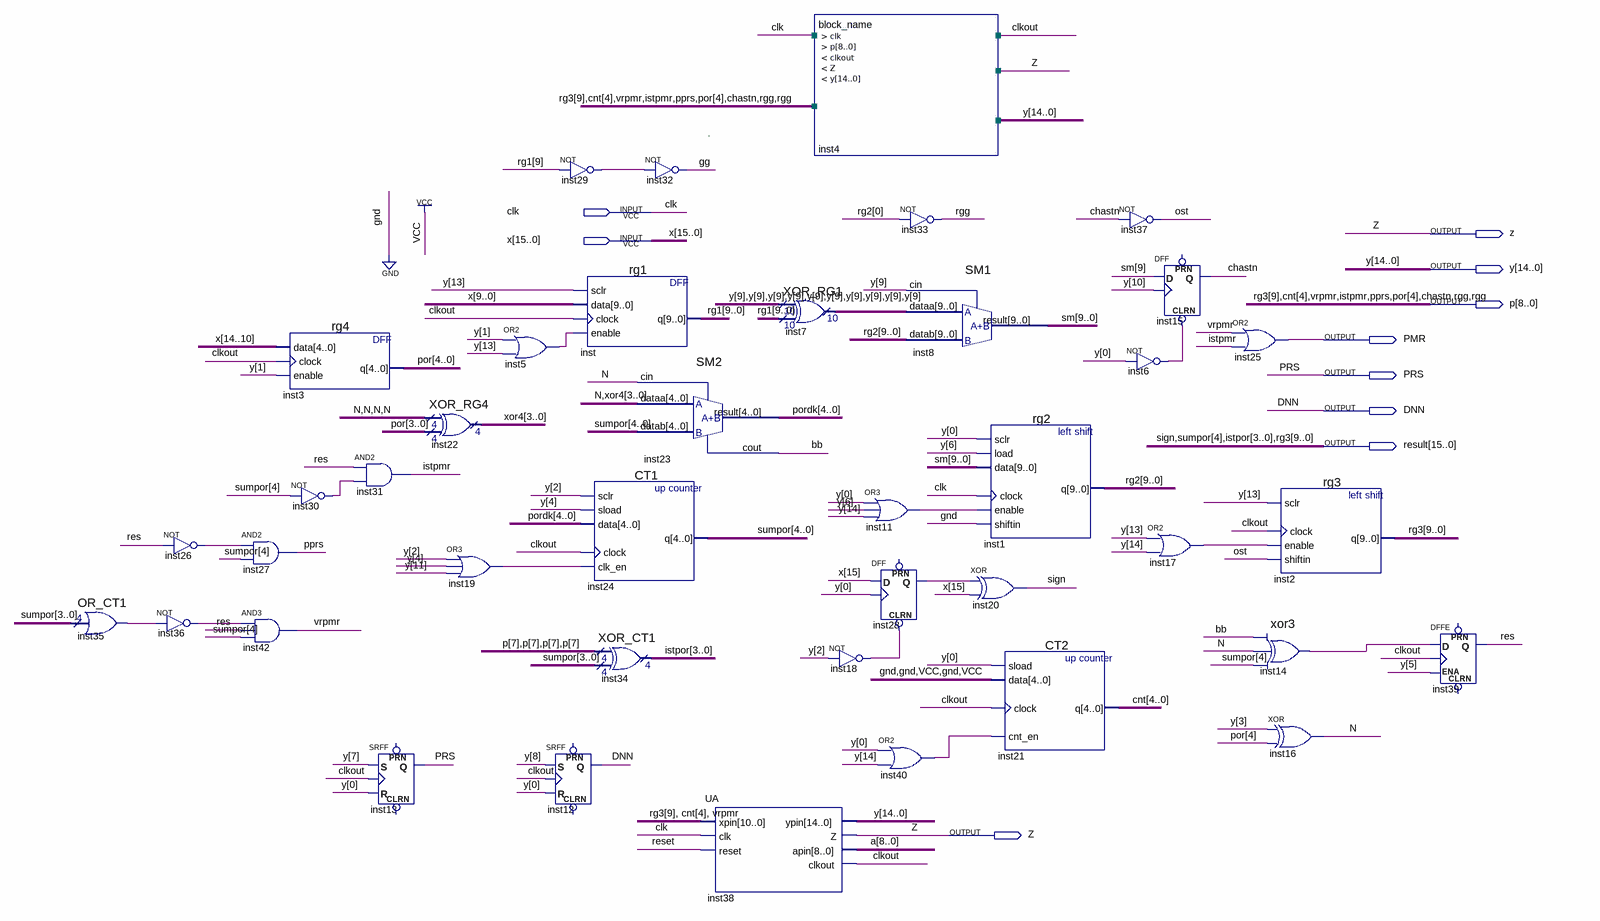
[diagram p0: schematic sheet]
// Quartus schematic Delenie.bdf as structural Verilog: 40 symbols, 10 pins
module Delenie (
  input  clk,
  input  [15:0] x,
  output z,
  output [14:0] y,
  output [8:0] p,
  output PMR,
  output PRS,
  output DNN,
  output [15:0] result
);

  wire bb, clkout, gg, inst5_out, inst6_out, inst11_out, inst14_result, inst17_out, inst18_out, inst19_out,
       inst26_out, inst28_q, inst29_out, inst30_out, inst35_result, inst36_out, inst40_out, N, ost, res,
       reset;
  wire [3:0] cnt, por, sumpor, xor4;
  wire [4:0] pordk;
  wire [8:0] a;
  wire [9:0] inst7_result, rg1, rg2, sm;

  OR_CT1 inst35 (.data(sumpor), .result(inst35_result));
  not inst26 (inst26_out, res);
  not inst36 (inst36_out, inst35_result);
  rg4 inst3 (.data(x[14:10]), .clock(clkout), .enable(y[1]), .q({p[3], por}));
  and inst27 (p[4], inst26_out, result[14]);
  and inst42 (p[6], inst36_out, res, result[14]);
  not inst30 (inst30_out, result[14]);
  and inst31 (p[5], res, inst30_out);
  SRFF inst13 (.S(y[7]), .R(y[0]), .CLK(clkout), .Q(PRS));  // open: PRN, CLRN
  XOR_RG4 inst22 (.data0x({4{N}}), .data1x(por), .result(xor4));
  or inst19 (inst19_out, y[2], y[4], y[11]);
  or inst5 (inst5_out, y[1], y[13]);
  not inst29 (inst29_out, rg1[9]);
  SRFF inst12 (.S(y[8]), .R(y[0]), .CLK(clkout), .Q(DNN));  // open: PRN, CLRN
  rg1 inst (.sclr(y[13]), .data(x[9:0]), .clock(clkout), .enable(inst5_out), .q(rg1));
  CT1 inst24 (.sclr(y[2]), .sload(y[4]), .data(pordk), .clock(clkout), .clk_en(inst19_out), .q({result[14], sumpor}));
  XOR_CT1 inst34 (.data0x({4{p[7]}}), .data1x(sumpor), .result(result[13:10]));
  not inst32 (gg, inst29_out);
  SM2 inst23 (.dataa({N, xor4}), .datab({result[14], sumpor}), .cin(N), .result(pordk), .cout(bb));
  UA inst38 (.xpin(p[8:6]), .clk(clk), .reset(reset), .ypin(y), .Z(z), .apin(a), .clkout(clkout));
  XOR_RG1 inst7 (.data0x({10{y[9]}}), .data1x(rg1), .result(inst7_result));
  block_name inst4 (.clk(clk), .clkout(clkout), .Z(z), .y(y));  // open: p
  not inst18 (inst18_out, y[2]);
  not inst33 (p[1], rg2[0]);
  SM1 inst8 (.dataa(inst7_result), .datab(rg2), .cin(y[9]), .result(sm));
  or inst11 (inst11_out, y[0], y[6], y[14]);
  DFF inst28 (.CLRN(inst18_out), .CLK(y[0]), .D(x[15]), .Q(inst28_q));  // open: PRN
  or inst40 (inst40_out, y[0], y[14]);
  rg2 inst1 (.sclr(y[0]), .load(y[6]), .data(sm), .clock(clk), .enable(inst11_out), .shiftin(1'b0), .q(rg2));
  xor inst20 (result[15], inst28_q, x[15]);
  CT2 inst21 (.sload(y[0]), .data(5'b00101), .clock(clkout), .cnt_en(inst40_out), .q({p[7], cnt}));
  not inst37 (ost, p[2]);
  not inst6 (inst6_out, y[0]);
  DFF inst15 (.CLRN(inst6_out), .CLK(y[10]), .D(sm[9]), .Q(p[2]));  // open: PRN
  or inst17 (inst17_out, y[13], y[14]);
  or inst25 (PMR, p[6], p[5]);
  rg3 inst2 (.sclr(y[13]), .clock(clkout), .enable(inst17_out), .shiftin(ost), .q({p[8], result[8:0]}));
  xor3 inst14 (.data0(bb), .data1(N), .data2(result[14]), .result(inst14_result));
  xor inst16 (N, y[3], p[3]);
  DFFE inst39 (.D(inst14_result), .CLK(clkout), .ENA(y[5]), .Q(res));  // open: PRN, CLRN

  assign p[0] = p[1];
  assign result[9] = p[8];

  // Other names for the same wires on the sheet: chastn = p[2]; cnt[4] = p[7]; istpmr = p[5];
  //   istpor[3:0] = result[13:10]; por[4] = p[3]; pprs = p[4]; rg3[9:0] = {p[8], result[8:0]}; rgg = p[1];
  //   sign = result[15]; sumpor[4] = result[14]; vrpmr = p[6]

  // Notes on the sheet:
  //   .
endmodule
